# Altium project Temperature_Sensor.PrjPcb
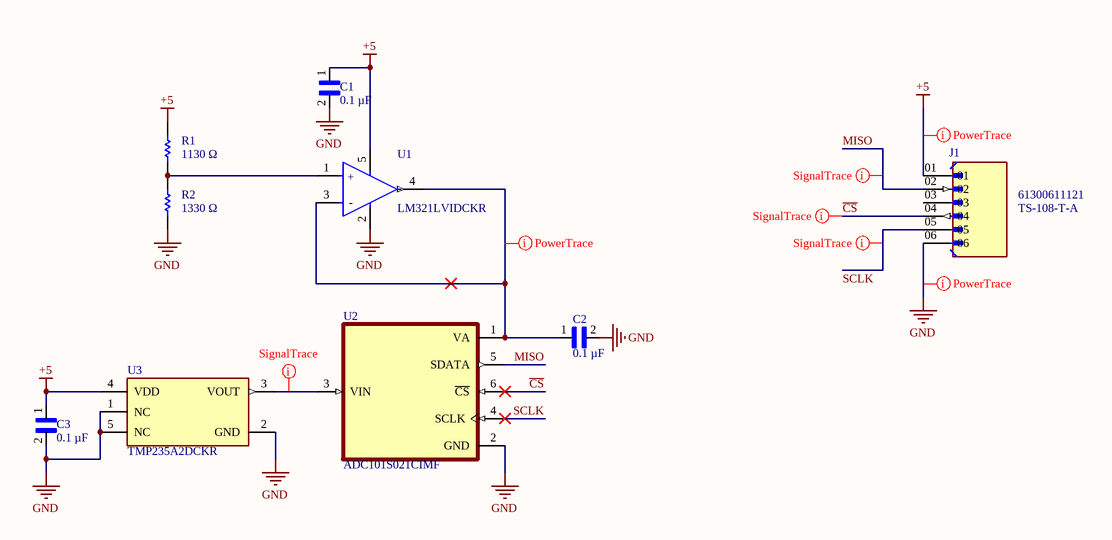
[diagram p0: Sheet1.SchDoc]
1 sheet, 9 parts. Net scope: global (net labels, ports and power ports of the same name join across sheets).
Board file: PCB1.PcbDoc

## Sheet Sheet1.SchDoc
size A; SheetNumber: 1; SheetTotal: 1

### Parts
C1  value 0.1 µF  [CAPC1005X55N]  (hidden comment: CC0402ZRY5V7BB104)
C2  value 0.1 µF  [CAPC1005X55N]  (hidden comment: CC0402ZRY5V7BB104)
C3  value 0.1 µF  [CAPC1005X55N]  (hidden comment: CC0402ZRY5V7BB104)
J1  61300611121  Supplier Part Number 1: TS-108-T-A  [CON-WURTH_61300611121]
R1  value 1130 Ω  [RESC1005X40X25ML05T10]  (hidden comment: RC0402FR-071K13L)
R2  value 1330 Ω  [RESC1005X40X25ML05T10]  (hidden comment: RC0402FR-071K33L)
U1  LM321LVIDCKR  [FP-DCK0005A-IPC_A]
U2  ADC101S021CIMF  [ADC-SOT95P280X145-6N]
U3  TMP235A2DCKR  [TMP-FP-DCK0005A-IPC_B]

### Nets
+5: C1.1 C3.1 J1.01 R1.2 U1.5(V+) U3.4(VDD)
GND: C1.2 C2.2 C3.2 J1.06 R2.2 U1.2(V-) U2.2(GND) U3.1(NC) U3.2(GND) U3.5(NC)
~{CS}: J1.04 U2.6(~{CS})
MISO: J1.02 U2.5(SDATA)
SCLK: J1.05 U2.4(SCLK)
NetC2_1: C2.1 U1.3(IN-) U1.4(OUT) U2.1(VA)
NetR1_1: R1.1 R2.1 U1.1(IN+)
NetU2_3: U2.3(VIN) U3.3(VOUT)

Not connected (* = marked no-connect by the designer): J1 03

### Layout directives
rule Width Constraint [Pref Width = 20mil    Min Width = 10mil    Max Width = 100mil]: +5, GND, NetC2_1
rule Width Constraint [Pref Width = 6mil    Min Width = 6mil    Max Width = 10mil]: MISO, NetU2_3, SCLK, ~{CS}

### Notes on the sheet
- (in symbol CMP-04895-000147-1) +; -

### Library data of the parts
C1-C3 = CC0402ZRY5V7BB104: 0.1ÂµF -20%, +80% 16V Ceramic Capacitor Y5V (F) 0402 (1005 Metric); MF: Yageo; MP: CC0402ZRY5V7BB104; Digi-Key_Part_Number: 311-1047-1-ND; Package: 0402 Yageo; SnapEDA_Link: https://www.snapeda.com/parts/CC0402ZRY5V7BB104/Yageo/view-part/1821018/?ref=snap
J1 = 61300611121: Board Connector, 48 Contact(s), 1 Row(s), Male, Straight, 0.1 inch Pitch, Solder Terminal, Black Insulator; Manufacturer: Samtec; Manufacturer Series: TS; MF: Wurth Electronics; Number of Contacts: 48; Option: General Purpose; Filter Feature: No; Mating Information: MULTIPLE MATING PARTS AVAILABLE; Number of Rows Loaded: 1; Contact Style: RND PIN-SKT; PCB Contact Pattern: RECTANGULAR; Body Length: 0.8inch; Plating Thickness: 200uin; Reference Standard: UL; Reliability: COMMERCIAL; SnapEDA_Link: https://www.snapeda.com/parts/61300611121/Wurth+Electronics+Inc./view-part/?ref=snap; Package: None; Value: *; MP: 61300611121; Check_prices: https://www.snapeda.com/parts/61300611121/Wurth+Electronics+Inc./view-part/?ref=eda; Supplier 1: Arrow Electronics; Manufacturer Part Number: TS-108-T-A; RoHS: Yes; Category: Connectors; Stock 1: 10; Pricing 1: 1=1.5, 50=1.17, 100=0.94, 500=0.8, 1000=0.64, 2000=0.58, 5000=0.47 (USD); Mounting Technology: Board; Contact Finish - Mating: TIN OVER COPPER (100); Contact Finish - Termination: TIN OVER COPPER (100); Contact Material: Brass; Insulation Color: Black; Insulation Material: Glass; Min Operating Temperature: -55°C; Max Operating Temperature: 105°C; JESD-609 Code: e3; Mounting Style: STRAIGHT; Termination: Solder; Connector Type: BOARD CONNECTOR; Contact Gender: Male; Mixed Contacts: No; Contact Pattern: RECTANGULAR; Number Of Connectors: 1; Number Of PCB Rows: 1; Terminal Pitch: 2.54mm; Body Breadth: 0.1inch; Mating Contact Pitch: 0.1inch; Terminal Length: 0.156inch; RoHS Compliant: Yes; Reach SVHC Compliant: No; DIN Conformance: No; IEC Conformance: No; MIL Conformance: No; ComponentLink1URL: https://datasheet.ciiva.com:443/pdfs/VipMasterIC/IC/SAMI/SAMI-S-A0001504555/SAMI-S-A0001504555-1.pdf?src-supplier=IHS+Markit; ComponentLink1Description: https://datasheet.ciiva.com:443/pdfs/VipMasterIC/IC/SAMI/SAMI-S-A0001504555/SAMI-S-A0001504555-1.pdf?src-supplier=IHS+Markit; ComponentLink2URL: https://datasheet.ciiva.com/410/tx-1xx-x-x-mkt1-410208.pdf?src-supplier=Digi-Key; ComponentLink2Description: https://datasheet.ciiva.com/410/tx-1xx-x-x-mkt1-410208.pdf?src-supplier=Digi-Key
R1 = CMP-1011-00515-2: Manufacturer: Yageo; Part Number: RC0402FR-071K13L
R2 = CMP-2002-07457-1: Manufacturer: Yageo; Part Number: RC0402FR-071K33L
U1 = CMP-04895-000147-1: IC OPAMP GP 1 CIRCUIT SC70-5; RoHS Compliant: Yes
U2 = ADC101S021CIMF: MF: {'manufacturer': u'Texas Instruments'}; MP: ADC101S021CIMFX/NOPB; Package: None; Price: None; Value: *; Availability: Unavailable
U3 = CMP-04948-000100-1: SENSOR ANALOG -40C-150C SC70-5; Output Type: Analog Voltage; RoHS Compliant: Yes; Mount: Surface Mount; Max Operating Temperature: 150°C; Packaging: Tape and Reel; Min Operating Temperature: -40°C; Interface: Analog